# Altium schematic sheet D1s.SchDoc
size A3; SheetNumber: 8; SheetTotal: 9
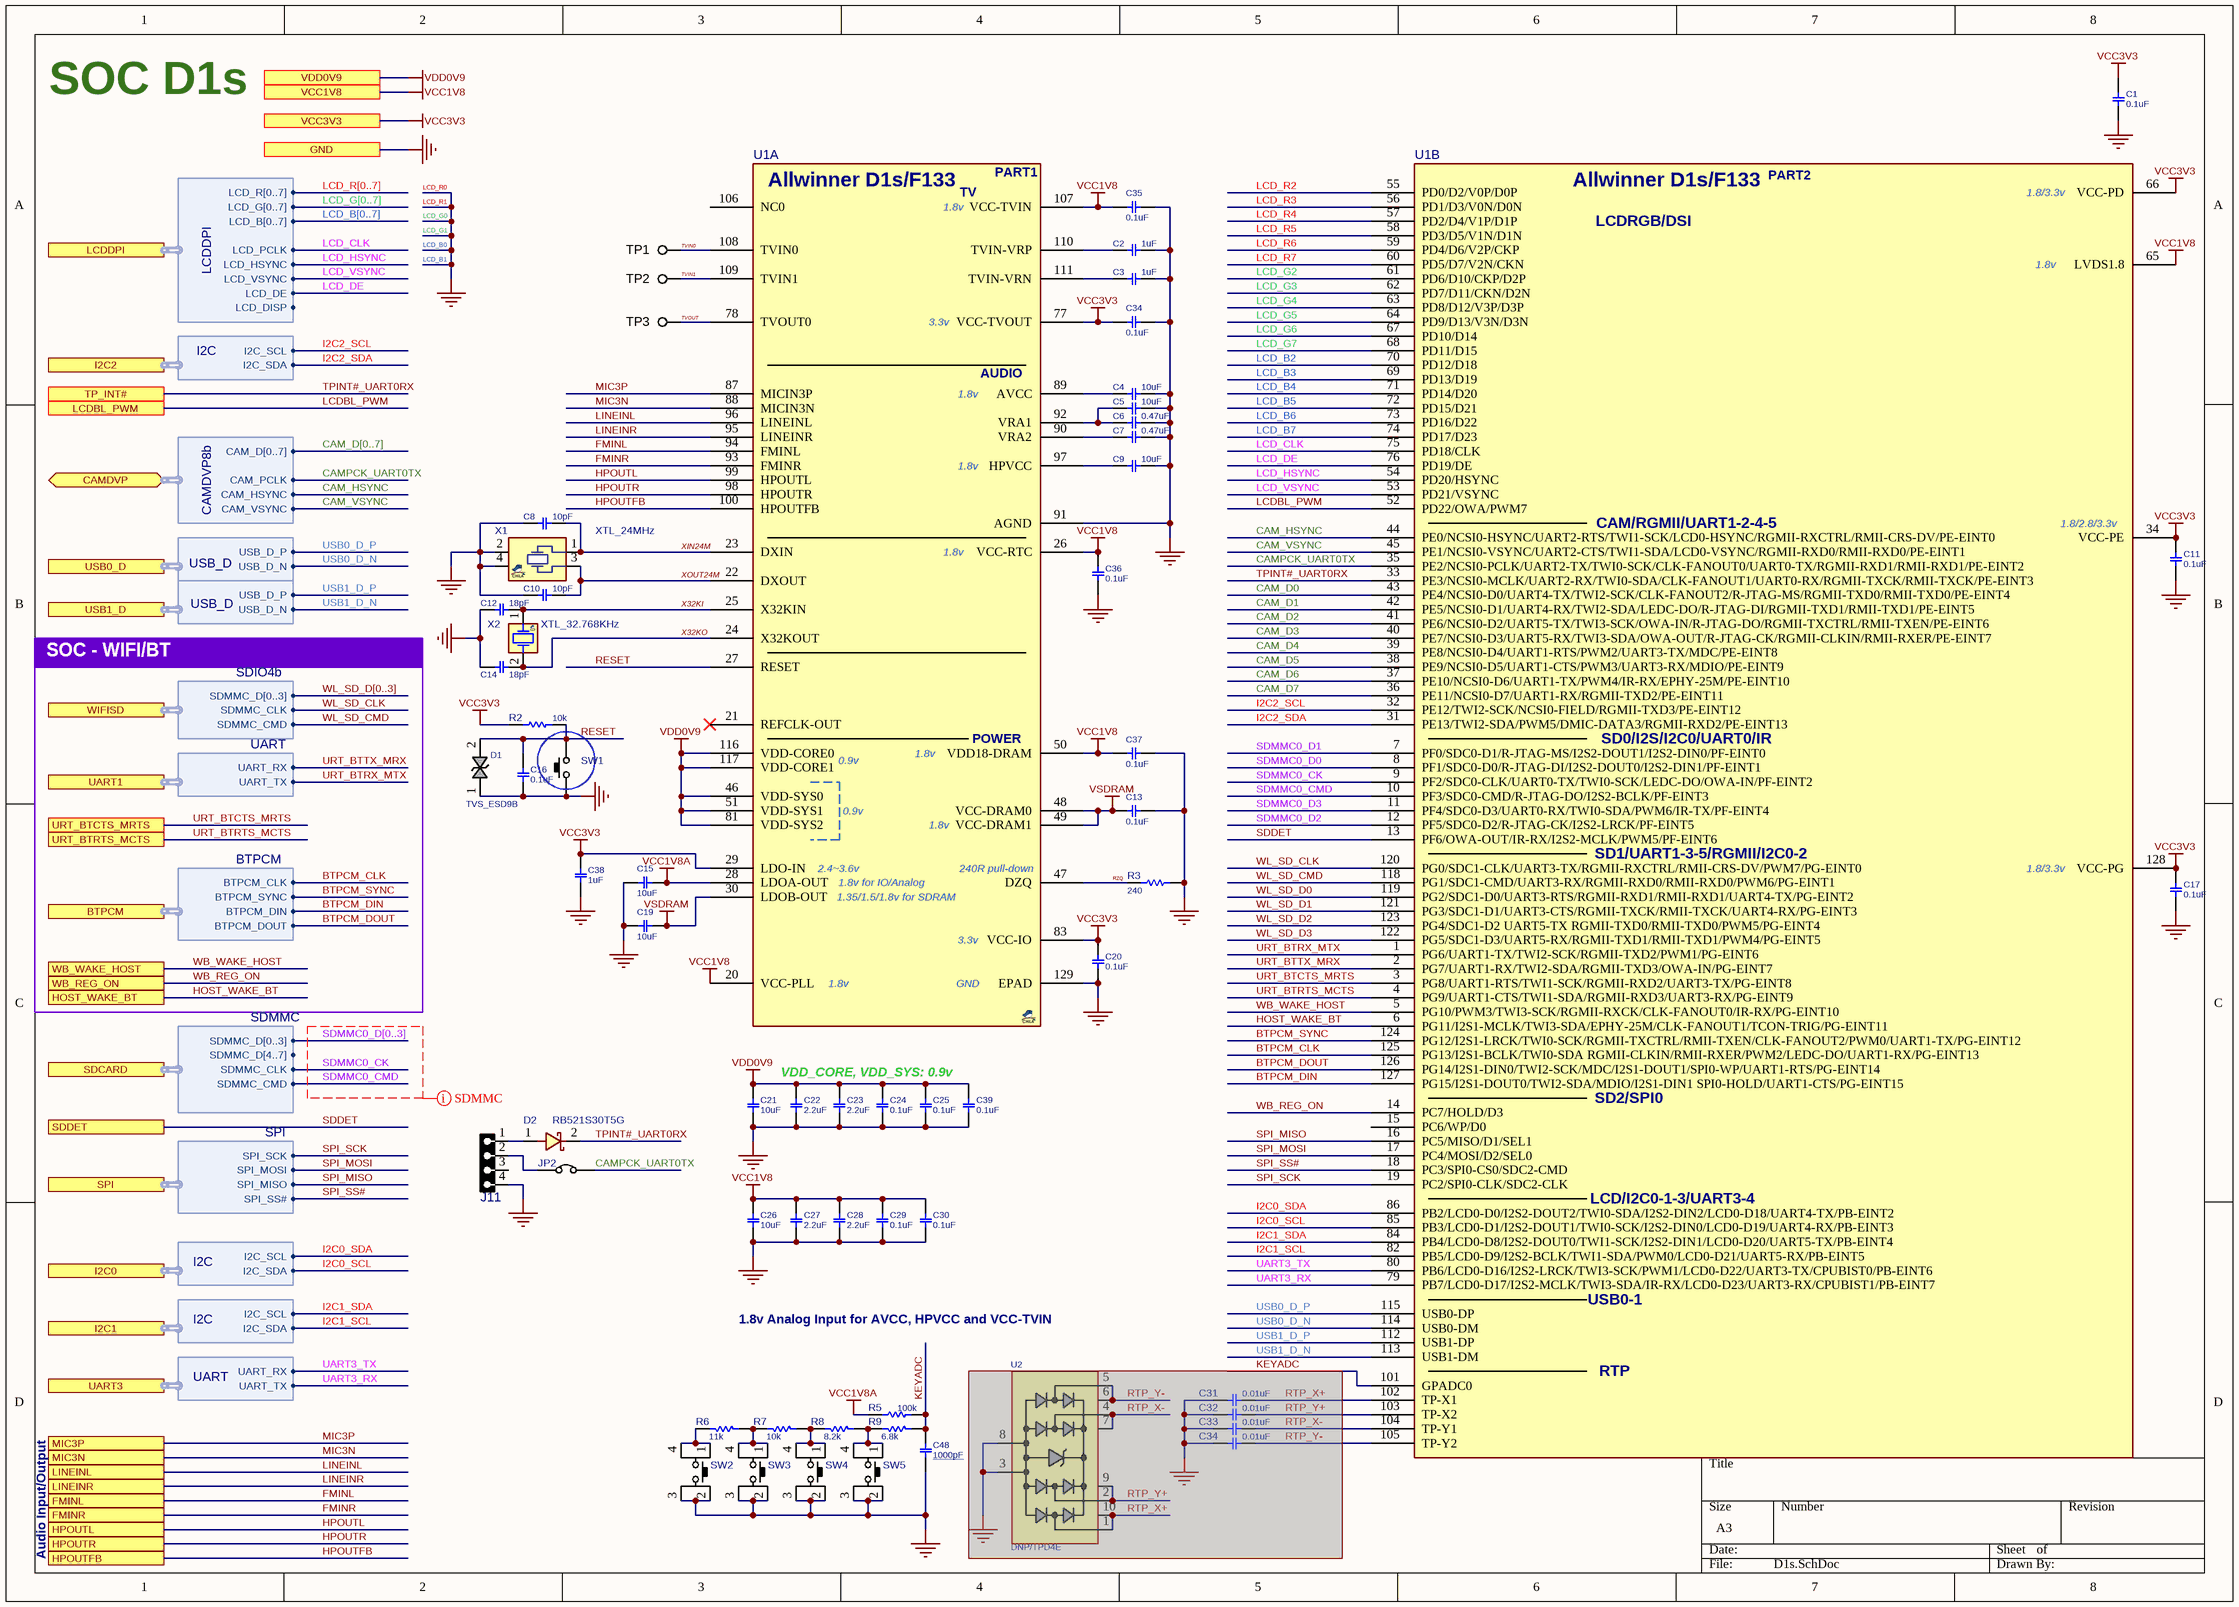
[diagram p0: D1s.SchDoc]

## Parts
(Parts that share a designator on the sheet are numbered #1, #2 ... from top to bottom, then left to right.)
C1  0.1uF  [C0402]
C2  1uF  [C0402]
C3  1uF  [C0402]
C4  10uF  [C0402]
C5  10uF  [C0402]
C6  0.47uF  [C0402]
C7  0.47uF  [C0402]
C8  10pF  [C0402]
C9  10uF  [C0402]
C10  10pF  [C0402]
C11  0.1uF  [C0402]
C12  18pF  [C0402]
C13  0.1uF  [C0402]
C14  18pF  [C0402]
C15  10uF  [C0402]
C16  0.1uF  [C0402]
C17  0.1uF  [C0402]
C19  10uF  [C0402]
C20  0.1uF  [C0402]
C21  10uF  [C0402]
C22  2.2uF  [C0402]
C23  2.2uF  [C0402]
C24  0.1uF  [C0402]
C25  0.1uF  [C0402]
C26  10uF  [C0402]
C27  2.2uF  [C0402]
C28  2.2uF  [C0402]
C29  0.1uF  [C0402]
C30  0.1uF  [C0402]
C31  0.01uF  [C0402]  (masked out: inside a compile mask, not in the netlist)
C32  0.01uF  [C0402]  (masked out: inside a compile mask, not in the netlist)
C33  0.01uF  [C0402]  (masked out: inside a compile mask, not in the netlist)
C34#1  0.1uF  [C0402]
C34#2  0.01uF  [C0402]  (masked out: inside a compile mask, not in the netlist)
C35  0.1uF  [C0402]
C36  0.1uF  [C0402]
C37  0.1uF  [C0402]
C38  1uF  [C0402]
C39  0.1uF  [C0402]
C48  1000pF  [C0402]
D1  TVS_ESD9B  [D_SOD923]
D2  RB521S30T5G  [D_SOD523]
J11  HDR1X4  [HDR127MAG_4]  (value not drawn)
JP2  solder  [JP_40X50]  (value not drawn)  (no BOM)
R2  10k  [R0402]
R3  240  [R0402]
R5  100k  [R0402]
R6  11k  [R0402]
R7  10k  [R0402]
R8  8.2k  [R0402]
R9  6.8k  [R0402]
SW1  PUSHBUTTON  [SWPBS_SPST_3X2X1]  (value not drawn)
SW2  PUSHBUTTON  [SWPBS_SPDT_R_KMS]  (value not drawn)
SW3  PUSHBUTTON  [SWPBS_SPDT_R_KMS]  (value not drawn)
SW4  PUSHBUTTON  [SWPBS_SPDT_R_KMS]  (value not drawn)
SW5  PUSHBUTTON  [SWPBS_SPDT_R_KMS]  (value not drawn)
TP1  TESTPOINT_PROBE  [TP80D50]  (value not drawn)  (no BOM)
TP2  TESTPOINT_PROBE  [TP80D50]  (value not drawn)  (no BOM)
TP3  TESTPOINT_PROBE  [TP80D50]  (value not drawn)  (no BOM)
U1  Allwinner D1s  [QFG40_128T]  (value not drawn)  (parts A,B of 2)
U2  DNP/TPD4E  [SON50_10_2510E]  (masked out: inside a compile mask, not in the netlist)
X1  XTL_24MHz  [XTL_4_2016]
X2  XTL_32.768KHz  [XTL_2_1610]

## Ports
BTPCM (harness BTPCM), CAMDVP (bidir, harness CAMDVP8b), FMINL, FMINR, GND, HOST_WAKE_BT, HPOUTFB, HPOUTL, HPOUTR, I2C0 (harness I2C), I2C1 (harness I2C), I2C2 (harness I2C), LCDBL_PWM, LCDDPI (harness LCDDPI), LINEINL, LINEINR, MIC3N, MIC3P, SDCARD (harness SDMMC), SDDET, SPI (harness SPI), TP_INT#, UART1 (harness UART), UART3 (harness UART), URT_BTCTS_MRTS, URT_BTRTS_MCTS, USB0_D (harness USB_D), USB1_D (harness USB_D), VCC1V8, VCC3V3, VDD0V9, WB_REG_ON, WB_WAKE_HOST, WIFISD (harness SDIO4b)

## Harnesses
LCDDPI: LCD_PCLK, LCD_HSYNC, LCD_VSYNC, LCD_DE, LCD_R[0..7], LCD_G[0..7], LCD_B[0..7], LCD_DISP
UART: UART_RX, UART_TX
SPI: SPI_SCK, SPI_MOSI, SPI_MISO, SPI_SS#
I2C: I2C_SCL, I2C_SDA
USB_D: USB_D_P, USB_D_N
SDIO4b: SDMMC_CMD, SDMMC_D[0..3], SDMMC_CLK
SDMMC: SDMMC_D[0..3], SDMMC_D[4..7], SDMMC_CLK, SDMMC_CMD
CAMDVP8b: CAM_D[0..7], CAM_PCLK, CAM_HSYNC, CAM_VSYNC
BTPCM: BTPCM_SYNC, BTPCM_CLK, BTPCM_DOUT, BTPCM_DIN

## Nets
LCD_B0: C1.1 C2.1 C3.1 C4.1 C5.1 C6.1 C7.1 C8.2 C9.1 C10.2 C11.1 C12.1 C13.1 C14.1 C15.2 C16.1 C17.1 C19.2 C20.1 C21.2 C22.2 C23.2 C24.1 C25.1 C26.2 C27.2 C28.2 C29.1 C30.1 C34#1.1 C35.1 C36.1 C37.1 C38.1 C39.1 C48.1 D1.1 J11.4 R3.1 SW1.1(P1) SW2.2 SW2.3 SW3.2 SW3.3 SW4.2 SW4.3 SW5.2 SW5.3 U1.91(AGND) U1.129(EPAD) X1.2 X1.4 ; port GND  [also labelled GND, LCD_B1, LCD_G0, LCD_G1, LCD_R0, LCD_R1]
VCC1V8: C26.1 C27.1 C28.1 C29.2 C30.2 C35.2 C36.2 C37.2 U1.20(VCC-PLL) U1.26(VCC-RTC) U1.50(VDD18-DRAM) U1.65(LVDS1.8) U1.107(VCC-TVIN) ; port VCC1V8
VCC1V8A: C15.1 R5.2 U1.28(LDOA-OUT)
VCC3V3: C1.2 C11.2 C17.2 C20.2 C34#1.2 C38.2 R2.2 U1.29(LDO-IN) U1.34(VCC-PE) U1.66(VCC-PD) U1.77(VCC-TVOUT) U1.83(VCC-IO) U1.128(VCC-PG) ; port VCC3V3
VDD0V9: C21.1 C22.1 C23.1 C24.2 C25.2 C39.2 U1.46(VDD-SYS0) U1.51(VDD-SYS1) U1.81(VDD-SYS2) U1.116(VDD-CORE0) U1.117(VDD-CORE1) ; port VDD0V9
VSDRAM: C13.2 C19.1 U1.30(LDOB-OUT) U1.48(VCC-DRAM0) U1.49(VCC-DRAM1)
BTPCM_CLK: U1.125(PG13/I2S1-BCLK/TWI0-SDA_RGMII-CLKIN/RMII-RXER/PWM2/LEDC-DO/UART1-RX/PG-EINT13) ; port BTPCM.BTPCM_CLK
BTPCM_DIN: U1.127(PG15/I2S1-DOUT0/TWI2-SDA/MDIO/I2S1-DIN1_SPI0-HOLD/UART1-CTS/PG-EINT15) ; port BTPCM.BTPCM_DIN
BTPCM_DOUT: U1.126(PG14/I2S1-DIN0/TWI2-SCK/MDC/I2S1-DOUT1/SPI0-WP/UART1-RTS/PG-EINT14) ; port BTPCM.BTPCM_DOUT
BTPCM_SYNC: U1.124(PG12/I2S1-LRCK/TWI0-SCK/RGMII-TXCTRL/RMII-TXEN/CLK-FANOUT2/PWM0/UART1-TX/PG-EINT12) ; port BTPCM.BTPCM_SYNC
CAM_D0: U1.43(PE4/NCSI0-D0/UART4-TX/TWI2-SCK/CLK-FANOUT2/R-JTAG-MS/RGMII-TXD0/RMII-TXD0/PE-EINT4)
CAM_D1: U1.42(PE5/NCSI0-D1/UART4-RX/TWI2-SDA/LEDC-DO/R-JTAG-DI/RGMII-TXD1/RMII-TXD1/PE-EINT5)
CAM_D2: U1.41(PE6/NCSI0-D2/UART5-TX/TWI3-SCK/OWA-IN/R-JTAG-DO/RGMII-TXCTRL/RMII-TXEN/PE-EINT6)
CAM_D3: U1.40(PE7/NCSI0-D3/UART5-RX/TWI3-SDA/OWA-OUT/R-JTAG-CK/RGMII-CLKIN/RMII-RXER/PE-EINT7)
CAM_D4: U1.39(PE8/NCSI0-D4/UART1-RTS/PWM2/UART3-TX/MDC/PE-EINT8)
CAM_D5: U1.38(PE9/NCSI0-D5/UART1-CTS/PWM3/UART3-RX/MDIO/PE-EINT9)
CAM_D6: U1.37(PE10/NCSI0-D6/UART1-TX/PWM4/IR-RX/EPHY-25M/PE-EINT10)
CAM_D7: U1.36(PE11/NCSI0-D7/UART1-RX/RGMII-TXD2/PE-EINT11)
CAM_HSYNC: U1.44(PE0/NCSI0-HSYNC/UART2-RTS/TWI1-SCK/LCD0-HSYNC/RGMII-RXCTRL/RMII-CRS-DV/PE-EINT0) ; port CAMDVP.CAM_HSYNC
CAM_VSYNC: U1.45(PE1/NCSI0-VSYNC/UART2-CTS/TWI1-SDA/LCD0-VSYNC/RGMII-RXD0/RMII-RXD0/PE-EINT1) ; port CAMDVP.CAM_VSYNC
CAMPCK_UART0TX: JP2.2 U1.35(PE2/NCSI0-PCLK/UART2-TX/TWI0-SCK/CLK-FANOUT0/UART0-TX/RGMII-RXD1/RMII-RXD1/PE-EINT2) ; port CAMDVP.CAM_PCLK
FMINL: U1.94(FMINL) ; port FMINL
FMINR: U1.93(FMINR) ; port FMINR
HOST_WAKE_BT: U1.6(PG11/I2S1-MCLK/TWI3-SDA/EPHY-25M/CLK-FANOUT1/TCON-TRIG/PG-EINT11) ; port HOST_WAKE_BT
HPOUTFB: U1.100(HPOUTFB) ; port HPOUTFB
HPOUTL: U1.99(HPOUTL) ; port HPOUTL
HPOUTR: U1.98(HPOUTR) ; port HPOUTR
I2C0_SCL: U1.85(PB3/LCD0-D1/I2S2-DOUT1/TWI0-SCK/I2S2-DIN0/LCD0-D19/UART4-RX/PB-EINT3) ; port I2C0.I2C_SDA
I2C0_SDA: U1.86(PB2/LCD0-D0/I2S2-DOUT2/TWI0-SDA/I2S2-DIN2/LCD0-D18/UART4-TX/PB-EINT2) ; port I2C0.I2C_SCL
I2C1_SCL: U1.82(PB5/LCD0-D9/I2S2-BCLK/TWI1-SDA/PWM0/LCD0-D21/UART5-RX/PB-EINT5) ; port I2C1.I2C_SDA
I2C1_SDA: U1.84(PB4/LCD0-D8/I2S2-DOUT0/TWI1-SCK/I2S2-DIN1/LCD0-D20/UART5-TX/PB-EINT4) ; port I2C1.I2C_SCL
I2C2_SCL: U1.32(PE12/TWI2-SCK/NCSI0-FIELD/RGMII-TXD3/PE-EINT12) ; port I2C2.I2C_SCL
I2C2_SDA: U1.31(PE13/TWI2-SDA/PWM5/DMIC-DATA3/RGMII-RXD2/PE-EINT13) ; port I2C2.I2C_SDA
KEYADC: C48.2 R5.1 R9.1
LCD_B2: U1.70(PD12/D18)
LCD_B3: U1.69(PD13/D19)
LCD_B4: U1.71(PD14/D20)
LCD_B5: U1.72(PD15/D21)
LCD_B6: U1.73(PD16/D22)
LCD_B7: U1.74(PD17/D23)
LCD_CLK: U1.75(PD18/CLK) ; port LCDDPI.LCD_PCLK
LCD_DE: U1.76(PD19/DE) ; port LCDDPI.LCD_DE
LCD_G2: U1.61(PD6/D10/CKP/D2P)
LCD_G3: U1.62(PD7/D11/CKN/D2N)
LCD_G4: U1.63(PD8/D12/V3P/D3P)
LCD_G5: U1.64(PD9/D13/V3N/D3N)
LCD_G6: U1.67(PD10/D14)
LCD_G7: U1.68(PD11/D15)
LCD_HSYNC: U1.54(PD20/HSYNC) ; port LCDDPI.LCD_HSYNC
LCD_R2: U1.55(PD0/D2/V0P/D0P)
LCD_R3: U1.56(PD1/D3/V0N/D0N)
LCD_R4: U1.57(PD2/D4/V1P/D1P)
LCD_R5: U1.58(PD3/D5/V1N/D1N)
LCD_R6: U1.59(PD4/D6/V2P/CKP)
LCD_R7: U1.60(PD5/D7/V2N/CKN)
LCD_VSYNC: U1.53(PD21/VSYNC) ; port LCDDPI.LCD_VSYNC
LCDBL_PWM: U1.52(PD22/OWA/PWM7) ; port LCDBL_PWM
LINEINL: U1.96(LINEINL) ; port LINEINL
LINEINR: U1.95(LINEINR) ; port LINEINR
MIC3N: U1.88(MICIN3N) ; port MIC3N
MIC3P: U1.87(MICIN3P) ; port MIC3P
RESET: C16.2 D1.2 R2.1 SW1.2(P3) U1.27(RESET)
RZQ: R3.2 U1.47(DZQ)
SDDET: U1.13(PF6/OWA-OUT/IR-RX/I2S2-MCLK/PWM5/PF-EINT6) ; port SDDET
SDMMC0_CK: U1.9(PF2/SDC0-CLK/UART0-TX/TWI0-SCK/LEDC-DO/OWA-IN/PF-EINT2) ; port SDCARD.SDMMC_CLK
SDMMC0_CMD: U1.10(PF3/SDC0-CMD/R-JTAG-DO/I2S2-BCLK/PF-EINT3) ; port SDCARD.SDMMC_CMD
SDMMC0_D0: U1.8(PF1/SDC0-D0/R-JTAG-DI/I2S2-DOUT0/I2S2-DIN1/PF-EINT1)
SDMMC0_D1: U1.7(PF0/SDC0-D1/R-JTAG-MS/I2S2-DOUT1/I2S2-DIN0/PF-EINT0)
SDMMC0_D2: U1.12(PF5/SDC0-D2/R-JTAG-CK/I2S2-LRCK/PF-EINT5)
SDMMC0_D3: U1.11(PF4/SDC0-D3/UART0-RX/TWI0-SDA/PWM6/IR-TX/PF-EINT4)
SPI_MISO: U1.16(PC5/MISO/D1/SEL1) ; port SPI.SPI_MISO
SPI_MOSI: U1.17(PC4/MOSI/D2/SEL0) ; port SPI.SPI_MOSI
SPI_SCK: U1.19(PC2/SPI0-CLK/SDC2-CLK) ; port SPI.SPI_SCK
SPI_SS#: U1.18(PC3/SPI0-CS0/SDC2-CMD) ; port SPI.SPI_SS#
TPINT#_UART0RX: D2.2 U1.33(PE3/NCSI0-MCLK/UART2-RX/TWI0-SDA/CLK-FANOUT1/UART0-RX/RGMII-TXCK/RMII-TXCK/PE-EINT3) ; port TP_INT#
TVIN0: TP1.1 U1.108(TVIN0)
TVIN1: TP2.1 U1.109(TVIN1)
TVOUT: TP3.1 U1.78(TVOUT0)
UART3_RX: U1.79(PB7/LCD0-D17/I2S2-MCLK/TWI3-SDA/IR-RX/LCD0-D23/UART3-RX/CPUBIST1/PB-EINT7) ; port UART3.UART_TX
UART3_TX: U1.80(PB6/LCD0-D16/I2S2-LRCK/TWI3-SCK/PWM1/LCD0-D22/UART3-TX/CPUBIST0/PB-EINT6) ; port UART3.UART_RX
URT_BTCTS_MRTS: U1.3(PG8/UART1-RTS/TWI1-SCK/RGMII-RXD2/UART3-TX/PG-EINT8) ; port URT_BTCTS_MRTS
URT_BTRTS_MCTS: U1.4(PG9/UART1-CTS/TWI1-SDA/RGMII-RXD3/UART3-RX/PG-EINT9) ; port URT_BTRTS_MCTS
URT_BTRX_MTX: U1.1(PG6/UART1-TX/TWI2-SCK/RGMII-TXD2/PWM1/PG-EINT6) ; port UART1.UART_TX
URT_BTTX_MRX: U1.2(PG7/UART1-RX/TWI2-SDA/RGMII-TXD3/OWA-IN/PG-EINT7) ; port UART1.UART_RX
USB0_D_N: U1.114(USB0-DM) ; port USB0_D.USB_D_N
USB0_D_P: U1.115(USB0-DP) ; port USB0_D.USB_D_P
USB1_D_N: U1.113(USB1-DM) ; port USB1_D.USB_D_N
USB1_D_P: U1.112(USB1-DP) ; port USB1_D.USB_D_P
WB_REG_ON: U1.14(PC7/HOLD/D3) ; port WB_REG_ON
WB_WAKE_HOST: U1.5(PG10/PWM3/TWI3-SCK/RGMII-RXCK/CLK-FANOUT0/IR-RX/PG-EINT10) ; port WB_WAKE_HOST
WL_SD_CLK: U1.120(PG0/SDC1-CLK/UART3-TX/RGMII-RXCTRL/RMII-CRS-DV/PWM7/PG-EINT0) ; port WIFISD.SDMMC_CLK
WL_SD_CMD: U1.118(PG1/SDC1-CMD/UART3-RX/RGMII-RXD0/RMII-RXD0/PWM6/PG-EINT1) ; port WIFISD.SDMMC_CMD
WL_SD_D0: U1.119(PG2/SDC1-D0/UART3-RTS/RGMII-RXD1/RMII-RXD1/UART4-TX/PG-EINT2)
WL_SD_D1: U1.121(PG3/SDC1-D1/UART3-CTS/RGMII-TXCK/RMII-TXCK/UART4-RX/PG-EINT3)
WL_SD_D2: U1.123(PG4/SDC1-D2_UART5-TX_RGMII-TXD0/RMII-TXD0/PWM5/PG-EINT4)
WL_SD_D3: U1.122(PG5/SDC1-D3/UART5-RX/RGMII-TXD1/RMII-TXD1/PWM4/PG-EINT5)
X32KI: C12.2 U1.25(X32KIN) X2.1(OSC1)
X32KO: C14.2 U1.24(X32KOUT) X2.2(OSC2)
XIN24M: C8.1 U1.23(DXIN) X1.1
XOUT24M: C10.1 U1.22(DXOUT) X1.3
NetC2_2: C2.2 U1.110(TVIN-VRP)
NetC3_2: C3.2 U1.111(TVIN-VRN)
NetC4_2: C4.2 U1.89(AVCC)
NetC5_2: C5.2 C6.2 U1.92(VRA1)
NetC7_2: C7.2 U1.90(VRA2)
NetC9_2: C9.2 U1.97(HPVCC)
NetD2_1: D2.1 J11.1
NetJ11_2: J11.2 JP2.1
NetR6_1: R6.1 R7.2 SW3.1 SW3.4
NetR6_2: R6.2 SW2.1 SW2.4
NetR7_1: R7.1 R8.2 SW4.1 SW4.4
NetR8_1: R8.1 R9.2 SW5.1 SW5.4

Not connected (* = marked no-connect by the designer): J11 3; U1 15(PC6/WP/D0) 21(REFCLK-OUT)* 101(GPADC0) 102(TP-X1) 103(TP-X2) 104(TP-Y1) 105(TP-Y2) 106(NC0)

## Buses and harness runs
bus CAM_D[0..7]
bus LCD_B[0..7]
bus LCD_G[0..7]
bus LCD_R[0..7]
bus SDMMC0_D[0..3]
bus WL_SD_D[0..3]

## Layout directives
net class SDMCU: SDMMC0_CK, SDMMC0_CMD, SDMMC0_D[0..3]

## Notes on the sheet
- SOC D1s
- SOC - WIFI/BT
- VDD_CORE, VDD_SYS: 0.9v
- 1.8v Analog Input for AVCC, HPVCC and VCC-TVIN
- Audio Input/Output
- (in symbol D1s_QFP128, part A) PART1; Allwinner D1s/F133; TV; 1.8v; 3.3v; AUDIO; POWER; 0.9v; 2.4~3.6v; 240R pull-down; 1.8v for IO/Analog; 1.35/1.5/1.8v for SDRAM; GND
- (in symbol D1s_QFP128, part B) PART2; Allwinner D1s/F133; 1.8/3.3v; LCDRGB/DSI; 1.8v; CAM/RGMII/UART1-2-4-5; 1.8/2.8/3.3v; SD0/I2S/I2C0/UART0/IR; SD1/UART1-3-5/RGMII/I2C0-2; SD2/SPI0; LCD/I2C0-1-3/UART3-4; USB0-1; RTP

## Library data of the parts
C1 C11 C13 C17 C20 C24 C25 C29 C30 C34#1 C35-C37 C39 = CAP_SMD_MLCC: CAP, MLCC; PARAM: X7R, 10%, -55~125oC; MANF_P#: GRM155R71H104KE14D; MANF: Murata; PARAM2: 50v; PRICE: 100: 0.018$; ASSEMBLY: ASSEMBLY; VALUE: 0.1uF
C2-C7 C9 C15 C19 C21-C23 C26-C28 C38 = CAP_SMD_MLCC: CAP, MLCC; PARAM: X5R, 10%; MANF_P#: GRM155R60J106ME15; MANF: Murata; PARAM2: 6.3v; PRICE: 10,000: $0.034; ASSEMBLY: ASSEMBLY
  C2 C3 C38: VALUE: 1uF
  C4 C5 C9 C15 C19 C21 C26: VALUE: 10uF
  C6 C7: VALUE: 0.47uF
  C22 C23 C27 C28: VALUE: 2.2uF
C8 C10 = CAP_SMD_MLCC: CAP, MLCC; PARAM: C0G, 5%; MANF_P#: CC0402JRNPO9BN180; MANF: Yageo; PARAM2: 50v; PRICE: 100: 0.009$; ASSEMBLY: ASSEMBLY; VALUE: 10pF
C12 C14 = CAP_SMD_MLCC: CAP, MLCC; PARAM: C0G; MANF_P#: CC0402CRNPO9BN3R3; MANF: YAGEO; PARAM2: 25v; PRICE: 10,000:	$0.006; ASSEMBLY: ASSEMBLY; VALUE: 18pF
C16 = CAP_SMD_MLCC: CAP, MLCC; PARAM: X5R, 10%; MANF_P#: CL03A104KP3NNWC; MANF: Samsung; PARAM2: 10v; PRICE: 10,000:$0.006; ASSEMBLY: ASSEMBLY; VALUE: 0.1uF
C31-C33 C34#2 = CAP_SMD_MLCC: CAP, MLCC; PARAM: X5R, 10%; PARAM2: 50v; PRICE: 50,000:	$0.006; MANF_P#: -; MANF: -; ASSEMBLY: ASSEMBLY; VALUE: 0.01uF
C48 = CAP_SMD_MLCC_0603: CAP, MLCC; PARAM: -, -%; MANF_P#: MANF_PART#; PARAM2: -V; PRICE: 100= 1$; MANF: -; ASSEMBLY: ASSEMBLY; VALUE: 1000pF
D1 = TVS_ESD9B3.3: TVS, ESD PROTECT, Bidirectional; MANF_P#: ESD9B3.3ST5G; MANF: ON; PARAM: 3.3VRWM; VALUE: TVS_ESD9B
D2 = DIODE_SMD_SCHOTTKY_1N5819: DIODE, SCHOTTKY; MANF: DIODES; DESC: DESCRIPTION; PARAM2: 0.2A; PARAM: 30V; MANF_P#: RB521S30T5G; ASSEMBLY: ASSEMBLY; PRICE: PRICE; VALUE: RB521S30T5G
J11 = HDRMINI_F_1X4: CONN, HEADER, Female, pitch: 1.27mm, 4POS; VALUE: HDRMINI_4
JP2 = JUMPER_SOLDER: JUMPER,  solder; MANF: MANF; MANF_P#: MANF_P#; VALUE: solder
R2 R3 = RES_SMD: RESISTOR, SMD; PARAM: 0.063W; DESC: DESCRIPTION; DIST#: MOUSER; PARAM2: 1%; MANF_P#: -; MANF: -; ASSEMBLY: ASSEMBLY; PRICE: 100= 0.3$
  R2: VALUE: 10k
  R3: VALUE: 240
R5-R9 = RES_SMD_0603: RESISTOR, SMD; PARAM: -W; DESC: DESCRIPTION; DIST#: MOUSER; PARAM2: 1%; MANF_P#: -; MANF: -; ASSEMBLY: ASSEMBLY; PRICE: 100= 0.5$
  R5: VALUE: 100k
  R6: VALUE: 11k
  R7: VALUE: 10k
  R8: VALUE: 8.2k
  R9: VALUE: 6.8k
SW1 = SWPBS_SPST_3X2_B3U-1000P: SWITCH, PUSH BUTTON, TACTILE, SMD, SPST, 3X2.5X1.2mm; MANF: OMRON; DESC: DESCRIPTION; VALUE: PUSHBUTTON; ASSEMBLY: ASSEMBLY; PARAM: PARAM; PRICE: 1$; MANF_P#: B3U-1000P
SW2-SW5 = SWPBS_SPDT_R_CK: SWITCH, PUSH BUTTON, TACTILE, THD, SPDT, RIGHT; PARAM: 50mA/32VDC; DESC: DESCRIPTION; MANF_P#: SKSCPCE010, ST-1186BE, GT-TC045A-H036-L1A, TS-1085S-B3, GT-TC045B-H036-L1A, EVQP7C01P, SKSCLDE010, EVQP7C01P, GT-TC041B-H036-L1N, GT-TC041A-H036-L1A, GT-TC047B-H016-L1A, KMS221GLFS; MANF: -; VALUE: PUSHBUTTON; ASSEMBLY: ASSEMBLY; PRICE: 0.07$
TP1-TP3 = TESTPOINT_PROBE: TEST POINT; MANF: MANF; MANF_P#: MANF_P#; VALUE: VALUE
U1 = D1s_QFP128: processor, RISC-V 533MHz w 64MB DDR2, eLQFP128; MANF_P#: F133, D1s; MANF: Allwinner; PARAM: RISC-V 533MHz w 64MB DDR2; VALUE: Allwinner D1s
U2 = TVS_X4_TPD4E05U06: TVS, ESD PROTECT, 4CH,; MANF_P#: TPD4E05U06DQA; MANF: Texas Instruments; PARAM2: 6.5Vbr, 0.4pF, –40°~125°C; PARAM: ±12-kV ContactD, ±15-kVAirD; PRICE: 0.6$; VALUE: DNP/TPD4E
X1 = XTL_4_40MHz_3225A: CRYSTAL; MANF: Murata; PARAM: -20~70oC; PARAM2: 10PPM, 6pF; ASSEMBLY: ASSEMBLY; PRICE: 0.4$; DIST#: -; MANF_P#: -; VALUE: XTL_24MHz
X2 = XTL_2_32.768_3215A: Crystal; MANF_P#: ABS05-32.768KHZ-9-T; PARAM2: 7pF, 20PPM; PARAM: -40~85oC; MANF: -; PRICE: 1$; VALUE: XTL_32.768KHz